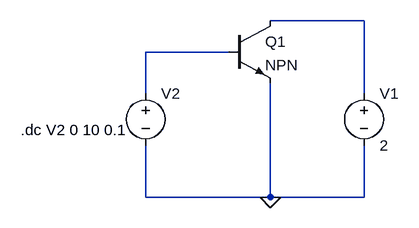
[diagram p0: schematic Vce=2V.asc]
Vce=2V.asc, the LTspice schematic file:
Version 4.1
SHEET 1 968 680
WIRE 320 64 176 64
WIRE 112 112 -16 112
WIRE -16 176 -16 112
WIRE 320 176 320 64
WIRE -16 336 -16 256
WIRE 176 336 176 160
WIRE 176 336 -16 336
WIRE 320 336 320 256
WIRE 320 336 176 336
FLAG 176 336 0
SYMBOL npn 112 64 R0
SYMATTR InstName Q1
SYMBOL voltage 320 160 R0
WINDOW 123 0 0 Left 0
WINDOW 39 0 0 Left 0
SYMATTR InstName V1
SYMATTR Value 2
SYMBOL voltage -16 160 R0
WINDOW 123 0 0 Left 0
WINDOW 39 0 0 Left 0
SYMATTR InstName V2
SYMATTR Value ""
TEXT -208 232 Left 2 !.dc V2 0 10 0.1

The netlist it stands for:
* Vce=2V.asc
Q1 N001 N002 0 0 NPN
V1 N001 0 2
V2 N002 0
.model NPN NPN
.model PNP PNP
.lib standard.bjt
.dc V2 0 10 0.1
.backanno
.end